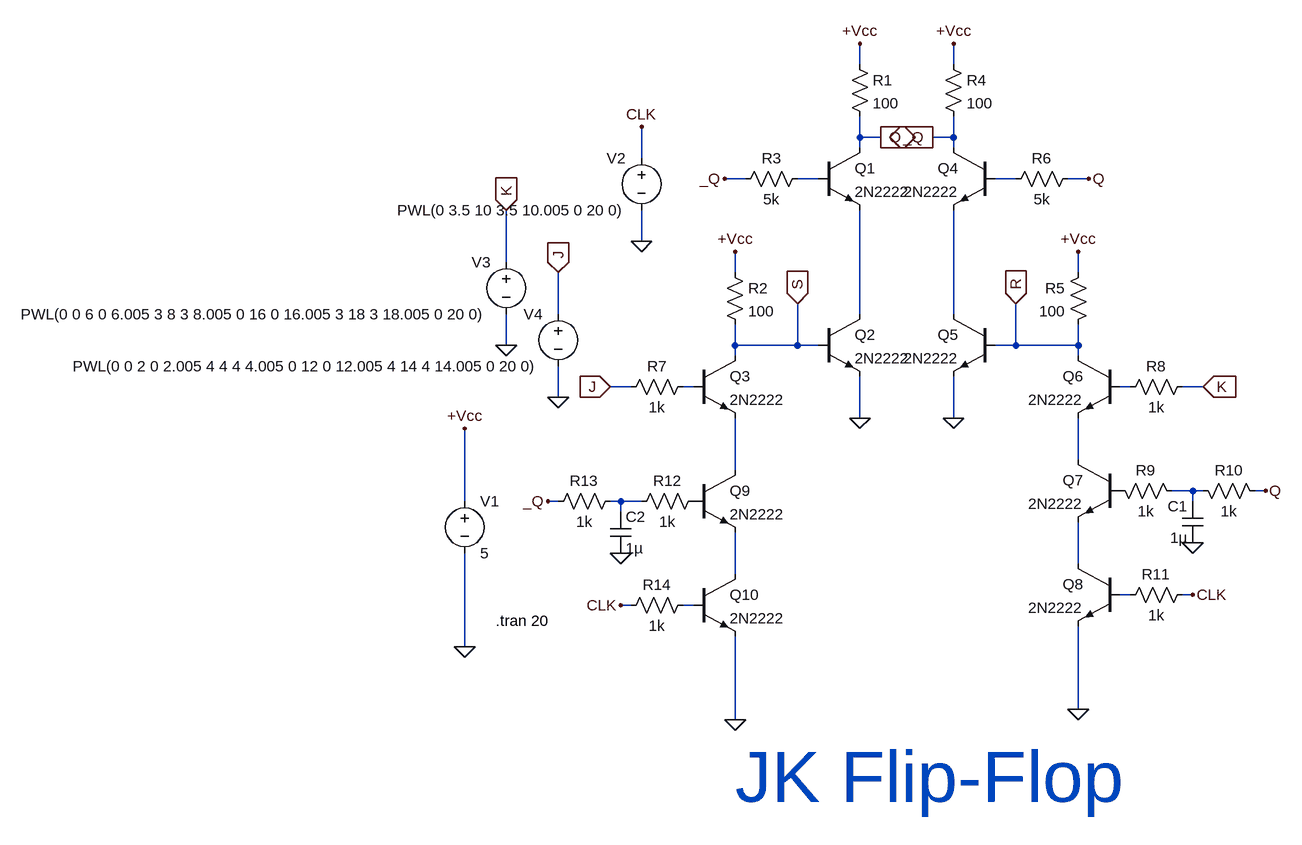
[diagram p0: schematic JK Flipflop.asc]
JK Flipflop.asc, the LTspice schematic file:
Version 4
SHEET 1 2108 1120
WIRE 320 -192 320 -224
WIRE 464 -192 464 -224
WIRE 320 -80 320 -112
WIRE 352 -80 320 -80
WIRE 464 -80 464 -112
WIRE 464 -80 432 -80
WIRE 320 -64 320 -80
WIRE 464 -64 464 -80
WIRE -16 -48 -16 -96
WIRE 144 -16 112 -16
WIRE 256 -16 224 -16
WIRE 560 -16 528 -16
WIRE 672 -16 640 -16
WIRE -16 80 -16 32
WIRE -224 112 -224 32
WIRE 128 128 128 96
WIRE 656 128 656 96
WIRE -144 192 -144 128
WIRE 320 192 320 32
WIRE 464 192 464 32
WIRE -224 240 -224 192
WIRE 128 240 128 208
WIRE 224 240 224 176
WIRE 224 240 128 240
WIRE 256 240 224 240
WIRE 560 240 560 176
WIRE 560 240 528 240
WIRE 656 240 656 208
WIRE 656 240 560 240
WIRE 128 256 128 240
WIRE 656 256 656 240
WIRE -32 304 -64 304
WIRE 64 304 48 304
WIRE 736 304 720 304
WIRE 848 304 816 304
WIRE -144 320 -144 272
WIRE 320 352 320 288
WIRE 464 352 464 288
WIRE 656 416 656 352
WIRE 128 432 128 352
WIRE 832 464 800 464
WIRE 848 464 832 464
WIRE 944 464 928 464
WIRE -288 480 -288 368
WIRE -144 480 -160 480
WIRE -48 480 -64 480
WIRE -16 480 -48 480
WIRE 832 480 832 464
WIRE -48 496 -48 480
WIRE 656 576 656 512
WIRE 128 592 128 528
WIRE 736 624 720 624
WIRE 832 624 816 624
WIRE -32 640 -48 640
WIRE 64 640 48 640
WIRE -288 704 -288 560
WIRE 656 800 656 672
WIRE 128 816 128 688
FLAG 432 -80 _Q
IOPIN 432 -80 Out
FLAG 352 -80 Q
IOPIN 352 -80 Out
FLAG 320 -224 +Vcc
FLAG 128 96 +Vcc
FLAG 320 352 0
FLAG 224 176 S
IOPIN 224 176 In
FLAG 112 -16 _Q
FLAG 464 -224 +Vcc
FLAG 656 96 +Vcc
FLAG 464 352 0
FLAG 560 176 R
IOPIN 560 176 In
FLAG 672 -16 Q
FLAG -64 304 J
IOPIN -64 304 In
FLAG 848 304 K
IOPIN 848 304 In
FLAG 832 544 0
FLAG 944 464 Q
FLAG 656 800 0
FLAG 832 624 CLK
FLAG -48 560 0
FLAG -160 480 _Q
FLAG 128 816 0
FLAG -48 640 CLK
FLAG -288 368 +Vcc
FLAG -288 704 0
FLAG -16 80 0
FLAG -16 -96 CLK
FLAG -224 240 0
FLAG -224 32 K
IOPIN -224 32 In
FLAG -144 320 0
FLAG -144 128 J
IOPIN -144 128 In
SYMBOL npn 256 -64 R0
SYMATTR InstName Q1
SYMATTR Value 2N2222
SYMBOL npn 256 192 R0
SYMATTR InstName Q2
SYMATTR Value 2N2222
SYMBOL Res 304 -208 R0
SYMATTR InstName R1
SYMATTR Value 100
SYMBOL npn 64 256 R0
SYMATTR InstName Q3
SYMATTR Value 2N2222
SYMBOL Res 112 112 R0
SYMATTR InstName R2
SYMATTR Value 100
SYMBOL Res 240 -32 R90
WINDOW 0 0 56 VBottom 2
WINDOW 3 32 56 VTop 2
SYMATTR InstName R3
SYMATTR Value 5k
SYMBOL npn 528 -64 M0
SYMATTR InstName Q4
SYMATTR Value 2N2222
SYMBOL npn 528 192 M0
SYMATTR InstName Q5
SYMATTR Value 2N2222
SYMBOL Res 448 -208 R0
SYMATTR InstName R4
SYMATTR Value 100
SYMBOL npn 720 256 M0
SYMATTR InstName Q6
SYMATTR Value 2N2222
SYMBOL Res 672 112 M0
SYMATTR InstName R5
SYMATTR Value 100
SYMBOL Res 544 0 R270
WINDOW 0 32 56 VTop 2
WINDOW 3 0 56 VBottom 2
SYMATTR InstName R6
SYMATTR Value 5k
SYMBOL Res 64 288 R90
WINDOW 0 0 56 VBottom 2
WINDOW 3 32 56 VTop 2
SYMATTR InstName R7
SYMATTR Value 1k
SYMBOL Res 720 320 R270
WINDOW 0 32 56 VTop 2
WINDOW 3 0 56 VBottom 2
SYMATTR InstName R8
SYMATTR Value 1k
SYMBOL npn 720 416 M0
SYMATTR InstName Q7
SYMATTR Value 2N2222
SYMBOL Res 704 448 M90
WINDOW 0 0 56 VBottom 2
WINDOW 3 32 56 VTop 2
SYMATTR InstName R9
SYMATTR Value 1k
SYMBOL Cap 848 480 M0
SYMATTR InstName C1
SYMATTR Value 1µ
SYMBOL Res 832 448 M90
WINDOW 0 0 56 VBottom 2
WINDOW 3 32 56 VTop 2
SYMATTR InstName R10
SYMATTR Value 1k
SYMBOL npn 720 576 M0
SYMATTR InstName Q8
SYMATTR Value 2N2222
SYMBOL Res 832 608 R90
WINDOW 0 0 56 VBottom 2
WINDOW 3 32 56 VTop 2
SYMATTR InstName R11
SYMATTR Value 1k
SYMBOL npn 64 432 R0
SYMATTR InstName Q9
SYMATTR Value 2N2222
SYMBOL Res 80 464 R90
WINDOW 0 0 56 VBottom 2
WINDOW 3 32 56 VTop 2
SYMATTR InstName R12
SYMATTR Value 1k
SYMBOL Cap -64 496 R0
SYMATTR InstName C2
SYMATTR Value 1µ
SYMBOL Res -48 464 R90
WINDOW 0 0 56 VBottom 2
WINDOW 3 32 56 VTop 2
SYMATTR InstName R13
SYMATTR Value 1k
SYMBOL npn 64 592 R0
SYMATTR InstName Q10
SYMATTR Value 2N2222
SYMBOL Res 64 624 R90
WINDOW 0 0 56 VBottom 2
WINDOW 3 32 56 VTop 2
SYMATTR InstName R14
SYMATTR Value 1k
SYMBOL voltage -288 464 R0
SYMATTR InstName V1
SYMATTR Value 5
SYMBOL voltage -16 -64 M0
SYMATTR InstName V2
SYMATTR Value PWL(0 3.5 10 3.5 10.005 0 20 0)
SYMBOL voltage -224 96 M0
SYMATTR InstName V3
SYMATTR Value PWL(0 0 6 0 6.005 3 8 3 8.005 0 16 0 16.005 3 18 3 18.005 0 20 0)
SYMBOL voltage -144 176 M0
SYMATTR InstName V4
SYMATTR Value PWL(0 0 2 0 2.005 4 4 4 4.005 0 12 0 12.005 4 14 4 14.005 0 20 0)
TEXT 128 904 Left 7 ;JK Flip-Flop
TEXT -240 664 Left 2 !.tran 20

The netlist it stands for:
* JK Flipflop.asc
Q1 Q N001 N003 0 2N2222
Q2 N003 S 0 0 2N2222
R1 +Vcc Q 100
Q3 S N005 N008 0 2N2222
R2 +Vcc S 100
R3 N001 _Q 5k
Q4 _Q N002 N004 0 2N2222
Q5 N004 R 0 0 2N2222
R4 +Vcc _Q 100
Q6 R N006 N007 0 2N2222
R5 +Vcc R 100
R6 N002 Q 5k
R7 N005 J 1k
R8 N006 K 1k
Q7 N007 P001 N011 0 2N2222
R9 P001 N009 1k
C1 N009 0 1µ
R10 N009 Q 1k
Q8 N011 N013 0 0 2N2222
R11 CLK N013 1k
Q9 N008 P002 N012 0 2N2222
R12 P002 N010 1k
C2 N010 0 1µ
R13 N010 _Q 1k
Q10 N012 N014 0 0 2N2222
R14 N014 CLK 1k
V1 +Vcc 0 5
V2 CLK 0 PWL(0 3.5 10 3.5 10.005 0 20 0)
V3 K 0 PWL(0 0 6 0 6.005 3 8 3 8.005 0 16 0 16.005 3 18 3 18.005 0 20 0)
V4 J 0 PWL(0 0 2 0 2.005 4 4 4 4.005 0 12 0 12.005 4 14 4 14.005 0 20 0)
.model NPN NPN
.model PNP PNP
.lib standard.bjt
* JK Flip-Flop
.tran 20
.backanno
.end